# Altium project MB2032.PrjPCB
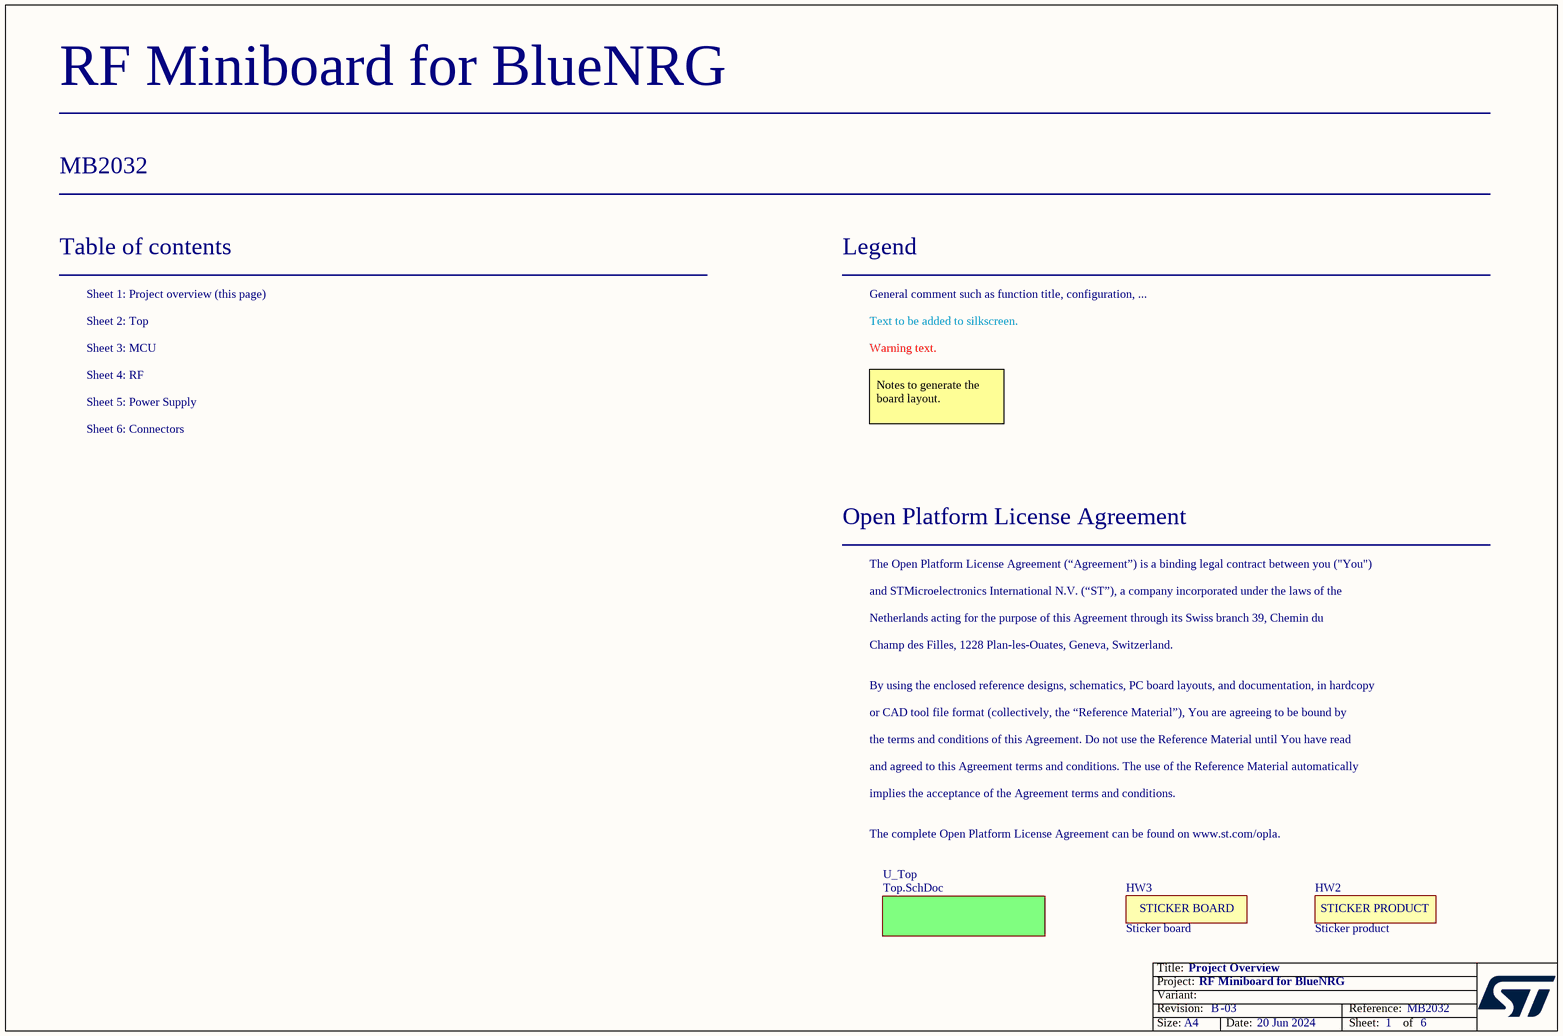
[diagram p0: Project_Overview.SchDoc]
Board_Reference: MB2032; Board_PCB_Revision: B; Board_Name: RF Miniboard for BlueNRG; Board_Document_Date: 20 Jun 2024; Board_Assembly_Revision: 03
6 sheets, 103 parts. Net scope: flat (ports and power ports of the same name join across sheets).
Board file: MB2032.PcbDoc
Sheets:
  Project_Overview.SchDoc
    U_Top = Top.SchDoc
      U_RF = RF.SchDoc
      U_Power_Supply = Power_Supply.SchDoc
      U_Connectors = Connectors.SchDoc
      U_MCU = MCU.SchDoc

## Sheet Project_Overview.SchDoc: Project Overview
size A4; Date: Not used; ApprovedBy: Not used; CheckedBy: Not used; Author: Not used; CompanyName: STMicroelectronics; DrawnBy: Not used; Engineer: Not used; Organization: Not used; Address1: Not used; Address2: Not used; Address3: Not used; Address4: Not used; DocumentNumber: Not used; Revision: Not used; SheetNumber: 1; SheetTotal: 6; CurrentTime: Not used; CurrentDate: Not used; Time: Not used; DocumentFullPathAndName: Not used; DocumentName: Not used; ModifiedDate: Not used; ImagePath: Not used; ProjectName: Not used; Application_BuildNumber: Not used

### Parts
HW2  value Sticker product  [STICKER_PRODUCT_25X5]  (hidden comment: STICKER_PRODUCT)  (no BOM)
HW3  value Sticker board  [STICKER_BOARD_25X5]  (hidden comment: STICKER_BOARD)  (no BOM)

### Sub-sheets
U_Top = Top.SchDoc: no entries

### Notes on the sheet
- Table of contents
- Sheet 1: Project overview (this page)
- Legend
- General comment such as function title, configuration, ...
- Sheet 2: Top
- Sheet 3: MCU
- Sheet 4: RF
- Text to be added to silkscreen.
- Warning text.
- Sheet 5: Power Supply
- Sheet 6: Connectors
- Notes to generate the board layout.
- Open Platform License Agreement
- The Open Platform License Agreement (“Agreement”) is a binding legal contract between you ("You")
- and STMicroelectronics International N.V. (“ST”), a company incorporated under the laws of the
- Netherlands acting for the purpose of this Agreement through its Swiss branch 39, Chemin du
- Champ des Filles, 1228 Plan-les-Ouates, Geneva, Switzerland.
- By using the enclosed reference designs, schematics, PC board layouts, and documentation, in hardcopy
- or CAD tool file format (collectively, the “Reference Material”), You are agreeing to be bound by
- the terms and conditions of this Agreement. Do not use the Reference Material until You have read
- and agreed to this Agreement terms and conditions. The use of the Reference Material automatically
- implies the acceptance of the Agreement terms and conditions.
- The complete Open Platform License Agreement can be found on www.st.com/opla.
- Title:
- Project:
- Size:
- Revision:
- Variant:
- A4
- -
- Date:
- Reference:
- Sheet:
- of
- (in symbol MCD-02189) STICKER PRODUCT
- (in symbol MCD-02190) STICKER BOARD

### Library data of the parts
HW2 = MCD-02189: Sticker product 25x5 mm; Part_Type: Misc; Part_Preference: Recommended; ID: 4289; ShowFields: YES; Internal_Part_Number: MCD-02189; Status: Released; Manufacturer: N/A; Manufacturer_Part_Number: N/A; Alternate_Manufacturer: N/A; Alternate_Manufacturer_Part_Number: N/A; ComponentLink1URL: N/A; Order_Code_Digikey: N/A; Order_Code_Farnell: N/A; Order_Code_RS: N/A
HW3 = MCD-02190: Sticker board 25x5 mm; Part_Type: Misc; Part_Preference: Recommended; ID: 4290; ShowFields: YES; Internal_Part_Number: MCD-02190; Status: Released; Manufacturer: N/A; Manufacturer_Part_Number: N/A; Alternate_Manufacturer: N/A; Alternate_Manufacturer_Part_Number: N/A; ComponentLink1URL: N/A; Order_Code_Digikey: N/A; Order_Code_Farnell: N/A; Order_Code_RS: N/A

## Sheet Top.SchDoc: Top Schematic
size A4; Date: Not used; ApprovedBy: Not used; CheckedBy: Not used; Author: Not used; CompanyName: STMicroelectronics; DrawnBy: Not used; Engineer: Not used; Organization: Not used; Address1: Not used; Address2: Not used; Address3: Not used; Address4: Not used; DocumentNumber: Not used; Revision: Not used; SheetNumber: 2; SheetTotal: 6; CurrentTime: Not used; CurrentDate: Not used; Time: Not used; DocumentFullPathAndName: Not used; DocumentName: Not used; ModifiedDate: Not used; ImagePath: Not used; ProjectName: Not used; Application_BuildNumber: Not used
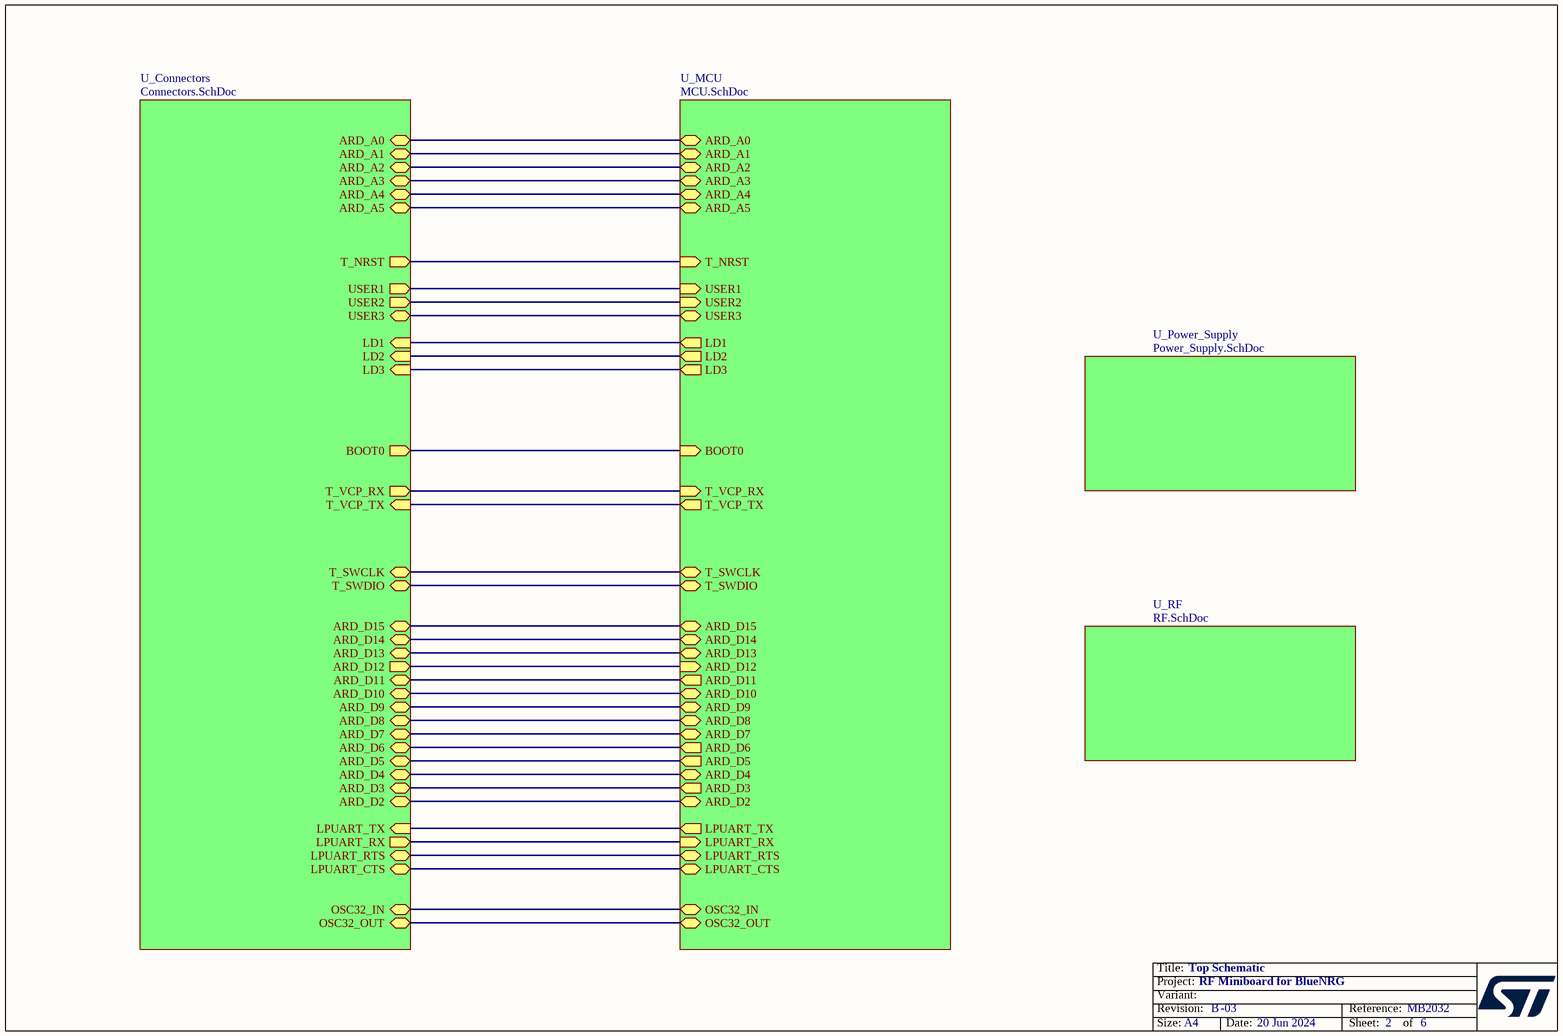
[diagram p1: Top.SchDoc]

### Sub-sheets
U_Connectors = Connectors.SchDoc: LD3 (in), LD1 (in), T_VCP_TX (in), T_SWCLK (bidir), T_SWDIO (bidir), T_VCP_RX (out), T_NRST (out), LD2 (in), OSC32_IN (bidir), OSC32_OUT (bidir), USER2 (out), USER1 (out), BOOT0 (out), ARD_D2 (bidir), USER3 (bidir), ARD_D9 (bidir), ARD_D13 (bidir), ARD_D10 (bidir), ARD_D12 (out), ARD_D14 (bidir), ARD_D15 (bidir), ARD_D11 (bidir), ARD_D8 (bidir), ARD_A1 (bidir), ARD_A0 (bidir), ARD_A2 (bidir), ARD_A3 (bidir), ARD_A4 (bidir), ARD_A5 (bidir), ARD_D7 (bidir), ARD_D6 (bidir), ARD_D3 (bidir), ARD_D4 (bidir), ARD_D5 (bidir), LPUART_TX (in), LPUART_RX (out), LPUART_RTS (bidir), LPUART_CTS (bidir)
U_MCU = MCU.SchDoc: T_NRST (in), LD2 (out), LD3 (out), LD1 (out), T_VCP_RX (in), T_SWCLK (bidir), T_SWDIO (bidir), T_VCP_TX (out), USER2 (in), USER1 (in), OSC32_OUT (bidir), OSC32_IN (bidir), BOOT0 (in), ARD_D2 (bidir), USER3 (bidir), ARD_D9 (bidir), ARD_D14 (bidir), ARD_D15 (bidir), ARD_D8 (bidir), ARD_D12 (in), ARD_D13 (bidir), ARD_A3 (bidir), ARD_A2 (bidir), ARD_A1 (bidir), ARD_A0 (bidir), ARD_A4 (bidir), ARD_A5 (bidir), ARD_D5 (out), ARD_D3 (out), ARD_D6 (out), ARD_D11 (out), ARD_D10 (bidir), ARD_D7 (bidir), ARD_D4 (bidir), LPUART_TX (out), LPUART_RX (in), LPUART_RTS (bidir), LPUART_CTS (bidir)
U_Power_Supply = Power_Supply.SchDoc: no entries
U_RF = RF.SchDoc: no entries

### Nets
(unnamed): sheet U_Connectors/LD3, sheet U_MCU/LD3
(unnamed): sheet U_Connectors/LD1, sheet U_MCU/LD1
(unnamed): sheet U_Connectors/T_VCP_TX, sheet U_MCU/T_VCP_TX
(unnamed): sheet U_Connectors/T_SWCLK, sheet U_MCU/T_SWCLK
(unnamed): sheet U_Connectors/T_SWDIO, sheet U_MCU/T_SWDIO
(unnamed): sheet U_Connectors/T_VCP_RX, sheet U_MCU/T_VCP_RX
(unnamed): sheet U_Connectors/T_NRST, sheet U_MCU/T_NRST
(unnamed): sheet U_Connectors/LD2, sheet U_MCU/LD2
(unnamed): sheet U_Connectors/OSC32_IN, sheet U_MCU/OSC32_IN
(unnamed): sheet U_Connectors/OSC32_OUT, sheet U_MCU/OSC32_OUT
(unnamed): sheet U_Connectors/USER2, sheet U_MCU/USER2
(unnamed): sheet U_Connectors/USER1, sheet U_MCU/USER1
(unnamed): sheet U_Connectors/BOOT0, sheet U_MCU/BOOT0
(unnamed): sheet U_Connectors/ARD_D2, sheet U_MCU/ARD_D2
(unnamed): sheet U_Connectors/USER3, sheet U_MCU/USER3
(unnamed): sheet U_Connectors/ARD_D9, sheet U_MCU/ARD_D9
(unnamed): sheet U_Connectors/ARD_D13, sheet U_MCU/ARD_D13
(unnamed): sheet U_Connectors/ARD_D10, sheet U_MCU/ARD_D10
(unnamed): sheet U_Connectors/ARD_D12, sheet U_MCU/ARD_D12
(unnamed): sheet U_Connectors/ARD_D14, sheet U_MCU/ARD_D14
(unnamed): sheet U_Connectors/ARD_D15, sheet U_MCU/ARD_D15
(unnamed): sheet U_Connectors/ARD_D11, sheet U_MCU/ARD_D11
(unnamed): sheet U_Connectors/ARD_D8, sheet U_MCU/ARD_D8
(unnamed): sheet U_Connectors/ARD_A1, sheet U_MCU/ARD_A1
(unnamed): sheet U_Connectors/ARD_A0, sheet U_MCU/ARD_A0
(unnamed): sheet U_Connectors/ARD_A2, sheet U_MCU/ARD_A2
(unnamed): sheet U_Connectors/ARD_A3, sheet U_MCU/ARD_A3
(unnamed): sheet U_Connectors/ARD_A4, sheet U_MCU/ARD_A4
(unnamed): sheet U_Connectors/ARD_A5, sheet U_MCU/ARD_A5
(unnamed): sheet U_Connectors/ARD_D7, sheet U_MCU/ARD_D7
(unnamed): sheet U_Connectors/ARD_D6, sheet U_MCU/ARD_D6
(unnamed): sheet U_Connectors/ARD_D3, sheet U_MCU/ARD_D3
(unnamed): sheet U_Connectors/ARD_D4, sheet U_MCU/ARD_D4
(unnamed): sheet U_Connectors/ARD_D5, sheet U_MCU/ARD_D5
(unnamed): sheet U_Connectors/LPUART_TX, sheet U_MCU/LPUART_TX
(unnamed): sheet U_Connectors/LPUART_RX, sheet U_MCU/LPUART_RX
(unnamed): sheet U_Connectors/LPUART_RTS, sheet U_MCU/LPUART_RTS
(unnamed): sheet U_Connectors/LPUART_CTS, sheet U_MCU/LPUART_CTS

### Notes on the sheet
- Title:
- Project:
- Size:
- Revision:
- Variant:
- A4
- -
- Date:
- Reference:
- Sheet:
- of

## Sheet RF.SchDoc: RF
size A4; Date: Not used; ApprovedBy: Not used; CheckedBy: Not used; Author: Not used; CompanyName: STMicroelectronics; DrawnBy: Not used; Engineer: Not used; Organization: Not used; Address1: Not used; Address2: Not used; Address3: Not used; Address4: Not used; DocumentNumber: Not used; Revision: Not used; SheetNumber: 4; SheetTotal: 6; CurrentTime: Not used; CurrentDate: Not used; Time: Not used; DocumentFullPathAndName: Not used; DocumentName: Not used; ModifiedDate: Not used; ImagePath: Not used; ProjectName: Not used; Application_BuildNumber: Not used
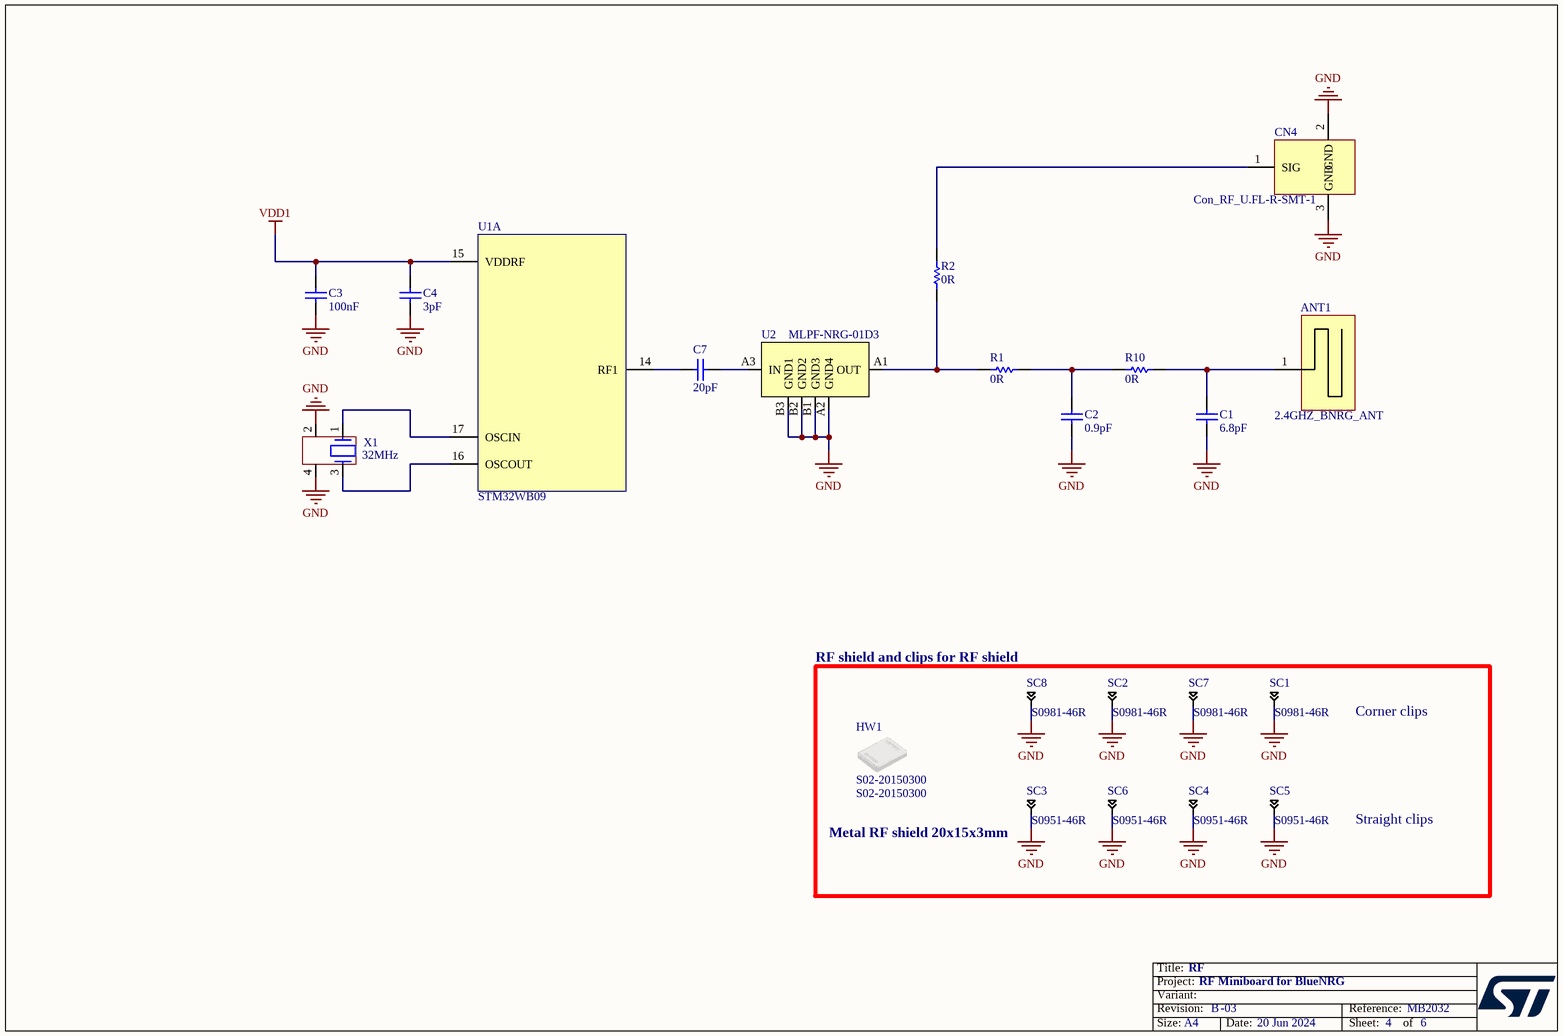
[diagram p2: RF.SchDoc]

### Parts
ANT1  value 2.4GHZ_BNRG_ANT  [ANT_BT_BNRG_2P4GHZ_MB2032]  (hidden comment: 2.4GHz_BT_ANT)  (no BOM)
C1  value 6.8pF  [C0402]  (hidden comment: Capacitor)
C2  value 0.9pF  [C0402_MURATA_GJM155_H0P5]  (hidden comment: Capacitor)
C3  value 100nF  [C0402]  (hidden comment: Capacitor)
C4  value 3pF  [C0402]  (hidden comment: Capacitor)
C7  value 20pF  [C0201_H0P3]  (hidden comment: Capacitor)
CN4  value Con_RF_U.FL-R-SMT-1  [CON_HRS_U.FL-R-SMT-1]  (hidden comment: U.FL-R-SMT-1)
HW1  S02-20150300  [SHIELD_HARWIN_S02-20150300_15X20_H3]
R1  value 0R  [R0402]  (hidden comment: Resistor)
R2  value 0R  [r0402]  (hidden comment: Resistor)
R10  value 0R  [R0402]  (hidden comment: Resistor)
SC1  value S0981-46R  [CLIP_HARWIN_S0981-46R]  (hidden comment: Shield-clip_S0951-46R)
SC2  value S0981-46R  [CLIP_HARWIN_S0981-46R]  (hidden comment: Shield-clip_S0951-46R)
SC3  value S0951-46R  [CLIP_HARWIN_S0951-46R]  (hidden comment: Shield-clip_S0951-46R)
SC4  value S0951-46R  [CLIP_HARWIN_S0951-46R]  (hidden comment: Shield-clip_S0951-46R)
SC5  value S0951-46R  [CLIP_HARWIN_S0951-46R]  (hidden comment: Shield-clip_S0951-46R)
SC6  value S0951-46R  [CLIP_HARWIN_S0951-46R]  (hidden comment: Shield-clip_S0951-46R)
SC7  value S0981-46R  [CLIP_HARWIN_S0981-46R]  (hidden comment: Shield-clip_S0951-46R)
SC8  value S0981-46R  [CLIP_HARWIN_S0981-46R]  (hidden comment: Shield-clip_S0951-46R)
U1  STM32WB09  [ICC_QFN32-EPAD_5X5_P050]  (part A of 5)
U2  value MLPF-NRG-01D3  [ICC_CSPG_6BUMPS_1X1P60_P050-P0577]  (hidden comment: MLPF-WB55-01E3)
X1  value 32MHz  [CRY_NX2016SA_4P]  (hidden comment: XTAL_4_PINS)

### Nets
GND: C1.1 C2.1 C3.1 C4.1 CN4.2(GND) CN4.3(GND) SC1.1 SC2.1 SC3.1 SC4.1 SC5.1 SC6.1 SC7.1 SC8.1 U2.A2(GND4) U2.B1(GND3) U2.B2(GND2) U2.B3(GND1) X1.2 X1.4
VDD1: C3.2 C4.2 U1.15(VDDRF)
NetANT1_1: ANT1.1 C1.2 R10.2
NetC2_2: C2.2 R1.2 R10.1
NetC7_1: C7.1 U1.14(RF1)
NetC7_2: C7.2 U2.A3(IN)
NetCN4_1: CN4.1(SIG) R2.2
NetR1_1: R1.1 R2.1 U2.A1(OUT)
NetU1_16: U1.16(OSCOUT) X1.3
NetU1_17: U1.17(OSCIN) X1.1

### Notes on the sheet
- (near SC8) RF shield and clips for RF shield
- Corner clips
- (near SC3) Metal RF shield 20x15x3mm
- Straight clips
- Title:
- Project:
- Size:
- Revision:
- Variant:
- A4
- -
- Date:
- Reference:
- Sheet:
- of

### Library data of the parts
ANT1 = MCD-03495: 2.4 GHZ Bluetooth BNRG PCB antenna; Part_Type: Misc; Part_Preference: Recommended; ShowFields: YES; ID: 5611; Component_Country_Of_Origin: Unknown; Internal_Part_Number: MCD-03495; Status: Checked; Manufacturer: N/A; Manufacturer_Part_Number: N/A; ComponentLink1URL: http://tunmcdsvn.tun.st.com/Component_Documentation_Library/Trunk; Order_Code_Digikey: N/A; Order_Code_Farnell: N/A; Order_Code_RS: N/A
C1 = MCD-03452: Capacitor, MLCC, 6.8pF, 50V, C0G, +/-0.05pF, 0402, T=0.5mm; Part_Preference: Recommended; Manufacturer: MURATA; Manufacturer_Part_Number: GJM1555C1H6R8WB01; Order_Code_RS: 3243259RL; ShowFields: YES; ID: 5568; Component_Country_Of_Origin: Japan, Singapore; Internal_Part_Number: MCD-03452; Status: Checked; Part_Type: Capacitor; Package: 0402; ComponentLink1URL: http://tunmcdsvn.tun.st.com/Component_Documentation_Library/Trunk/Capacitor/MURATA_GJM_Series/GJM1555C1H6R8WB01; Order_Code_Digikey: 490-14447-2-ND; Order_Code_Farnell: 3243259RL
C2 = MCD-04106: Capacitor, MLCC, 0.9pF, 50V, COG, +/-0.05pF, 0402, T=0.5mm; Part_Preference: Recommended; Manufacturer: MURATA; Manufacturer_Part_Number: GJM1555C1HR90WB01; Order_Code_RS: 185-3185; ShowFields: YES; ID: 6222; Internal_Part_Number: MCD-04106; Status: Checked; Part_Type: Capacitor; Package: 0402; ComponentLink1URL: http://tunmcdsvn.tun.st.com/Component_Documentation_Library/Trunk/Capacitor/MURATA_GJM_Series/GJM1555C1HR90WB01D; Order_Code_Digikey: 490-11254-2-ND; Order_Code_Farnell: 3243276
C3 = MCD-03442: Capacitor, MLCC, 100nF, ±10%, X7R, 25V, 0402, T=0.5mm; Part_Preference: Recommended; Manufacturer: MURATA; Manufacturer_Part_Number: GRM155R71E104KE14D; Order_Code_RS: NA; ShowFields: YES; ID: 5558; Component_Country_Of_Origin: China, Japan, Philippines, Singapore; Internal_Part_Number: MCD-03442; Status: Checked; Part_Type: Capacitor; Package: 0402; ComponentLink1URL: http://tunmcdsvn.tun.st.com/Component_Documentation_Library/Trunk/Capacitor/MURATA_GRM_Series/GRM155R71E104KE14; Order_Code_Digikey: 490-10698-2-ND; Order_Code_Farnell: NA
C4 = MCD-03898: Capacitor, C0G, 3 pF, 50V, NPO, ±0.1pF, 0402, T=0.5mm; Part_Preference: Recommended; Manufacturer: WALSIN TECHNOLOGY CORPORATION; Manufacturer_Part_Number: 0402N3R0B500CT; Order_Code_RS: NA; ShowFields: YES; ID: 6014; Internal_Part_Number: MCD-03898; Status: New; Part_Type: Capacitor; Package: 0402; ComponentLink1URL: http://tunmcdsvn.tun.st.com/Component_Documentation_Library/Trunk/Capacitor/WALSIN_Monolithic_Series/0402N3R0B500CT; Order_Code_Digikey: 1292-1315-2-ND; Order_Code_Farnell: NA
C7 = MCD-03543: Capacitor, MLCC, 20pF, 25V, COG, +/-2%, 0201, T=0.33mm; Part_Preference: Recommended; Manufacturer: MURATA; Manufacturer_Part_Number: GJM0335C1E200GB01; ShowFields: YES; ID: 5659; Component_Country_Of_Origin: Japan, Singapore; Internal_Part_Number: MCD-03543; Status: Checked; Part_Type: Capacitor; ComponentLink1URL: http://tunmcdsvn.tun.st.com/Component_Documentation_Library/Trunk/Capacitor/MURATA_GJM_Series; Order_Code_Digikey: 490-GJM0335C1E200GB01DTR-ND; Order_Code_Farnell: 2994012; Order_Code_RS: N/A; Package: 0201
CN4 = MCD-01583: Connector_RF, 0Hz to 6GHz, 50R, VR, SMD, T= 1.25mm; BMS_Part_Number: 9187005; Part_Preference: Recommended; Manufacturer: HIROSE; Order_Code_RS: 557-981; Component_Country_Of_Origin: Japan, Malaysia; ShowFields: YES; ID: 3683; Internal_Part_Number: MCD-01583; Status: Released; Part_Type: Connector; Manufacturer_Part_Number: U.FL-R-SMT-1; ComponentLink1URL: http://tunmcdsvn.tun.st.com/Component_Documentation_Library/Trunk/Connector/HIROSE_U.FL_Series/; Order_Code_Digikey: N/A; Order_Code_Farnell: 1688077
HW1 = MCD-03126: RFI shield can, 20x15x3mm; Part_Type: Misc; Part_Preference: Recommended; Manufacturer: HARWIN; Order_Code_RS: 161-3687; Component_Country_Of_Origin: UK°; ShowFields: YES; ID: 5242; ComponentLink1URL: http://tunmcdsvn.tun.st.com/Component_Documentation_Library/Trunk/Misc/HARWIN_S02-20150300; Internal_Part_Number: MCD-03126; Value: S02-20150300; Status: Checked; Manufacturer_Part_Number: S02-20150300; Package: 20x15x3mm; Order_Code_Digikey: 952-2632-ND; Order_Code_Farnell: 3755471
R1 R2 R10 = MCD-00052: Resistor, 0R, 0402, +/-5%, 1/16W; Part_Preference: Recommended; Manufacturer: YAGEO; Manufacturer_Part_Number: RC0402JR-070RL; Order_Code_RS: 9232516RL; Component_Country_Of_Origin: China; ShowFields: YES; ID: 2540; Internal_Part_Number: MCD-00052; Status: Released; Part_Type: Resistor; Package: 0402; ComponentLink1URL: http://tunmcdsvn.tun.st.com/Component_Documentation_Library/Trunk/Resistor/YAGEO_RC_L_Series; Order_Code_Digikey: 311-0.0JRCT-ND; Order_Code_Farnell: 9232516RL
SC1 SC2 SC7 SC8 = MCD-02164: shield clip Harwin S0981-46R to fix RF shielded cavity - SMT RFI Shield Clip, Corner (T+R); Part_Type: Mechanical; Part_Preference: Recommended; Order_Code_RS: 161-3702; Component_Country_Of_Origin: South Korea; ShowFields: YES; ID: 4264; Internal_Part_Number: MCD-02164; Status: Released; Manufacturer: HARWIN; Manufacturer_Part_Number: S0981-46R; ComponentLink1URL: http://tunmcdsvn.tun.st.com/Component_Documentation_Library/Trunk/Misc/HARWIN_S0981-46R; Order_Code_Digikey: 952-2518-1-ND; Order_Code_Farnell: 2361678; Package: 0.8x4.7x1.4mm
SC3-SC6 = MCD-01587: shield clip Harwin S0951-46R to fix RF shielded cavity; Part_Type: Mechanical; Part_Preference: Recommended; Component_Country_Of_Origin: South Korea; ShowFields: YES; ID: 3687; Internal_Part_Number: MCD-01587; Status: Released; Manufacturer: HARWIN; Manufacturer_Part_Number: S0951-46R; ComponentLink1URL: http://tunmcdsvn.tun.st.com/Component_Documentation_Library/Trunk/Misc/HARWIN_S0951-46R; Order_Code_Digikey: 952-2669-1-ND; Order_Code_Farnell: 2490970; Order_Code_RS: N/A; Package: 1.1x3.9mm
U1 = MCD-03444: Bluetooth® Low Energy wireless SoC; Part_Type: IC; Part_Preference: Recommended; Manufacturer: STMICROELECTRONICS; Component_Country_Of_Origin: Unknown; ShowFields: YES; ID: 5560; Internal_Part_Number: MCD-03444; Value: STM32WB09; Status: Checked; Manufacturer_Part_Number: STM32WB09; Package: QFN32; ComponentLink1URL: http://tunmcdsvn.tun.st.com/Component_Documentation_Library/Trunk/IC/STMICROELECTRONICS_BLUENRG-372AC; Order_Code_Digikey: N/A; Order_Code_Farnell: N/A; Order_Code_RS: N/A
U2 = MCD-03490: 2.4 GHz low pass filter matched to BLUENRG-LP-LPS; Part_Type: IC; Part_Preference: Recommended; Manufacturer: STMICROELECTRONICS; ShowFields: YES; ID: 5606; Component_Country_Of_Origin: China; Internal_Part_Number: MCD-03490; Status: Checked; Manufacturer_Part_Number: MLPF-NRG-01D3; Package: CSP; ComponentLink1URL: http://tunmcdsvn.tun.st.com/Component_Documentation_Library/Trunk/IC/STMICROELECTRONICS_MLPF-NRG-01D3; Order_Code_Digikey: 497-MLPF-NRG-01D3TR-ND; Order_Code_Farnell: N/A; Order_Code_RS: N/A
X1 = MCD-01446: Crystal, 32MHz, 8pF, +/-10ppm, 60R, 2x1.6mm; BMS_Part_Number: 9157042; Part_Type: Crystal_Osc; Part_Preference: Recommended; Manufacturer: NDK; Manufacturer_Part_Number: NX2016SA-32MHZ-EXS00A-CS06654; Component_Country_Of_Origin: Unknown; ShowFields: YES; ID: 3546; Internal_Part_Number: MCD-01446; Status: Checked; Package: 2x1.6mm; ComponentLink1URL: http://tunmcdsvn.tun.st.com/Component_Documentation_Library/Trunk/Crytal_Oscillator/NDK_NX2016SA_Series; Order_Code_Digikey: 644-1373; Order_Code_Farnell: N/A; Order_Code_RS: N/A

## Sheet Power_Supply.SchDoc: Power Supply
size A4; Date: Not used; ApprovedBy: Not used; CheckedBy: Not used; Author: Not used; CompanyName: STMicroelectronics; DrawnBy: Not used; Engineer: Not used; Organization: Not used; Address1: Not used; Address2: Not used; Address3: Not used; Address4: Not used; DocumentNumber: Not used; Revision: Not used; SheetNumber: 5; SheetTotal: 6; CurrentTime: Not used; CurrentDate: Not used; Time: Not used; DocumentFullPathAndName: Not used; DocumentName: Not used; ModifiedDate: Not used; ImagePath: Not used; ProjectName: Not used; Application_BuildNumber: Not used
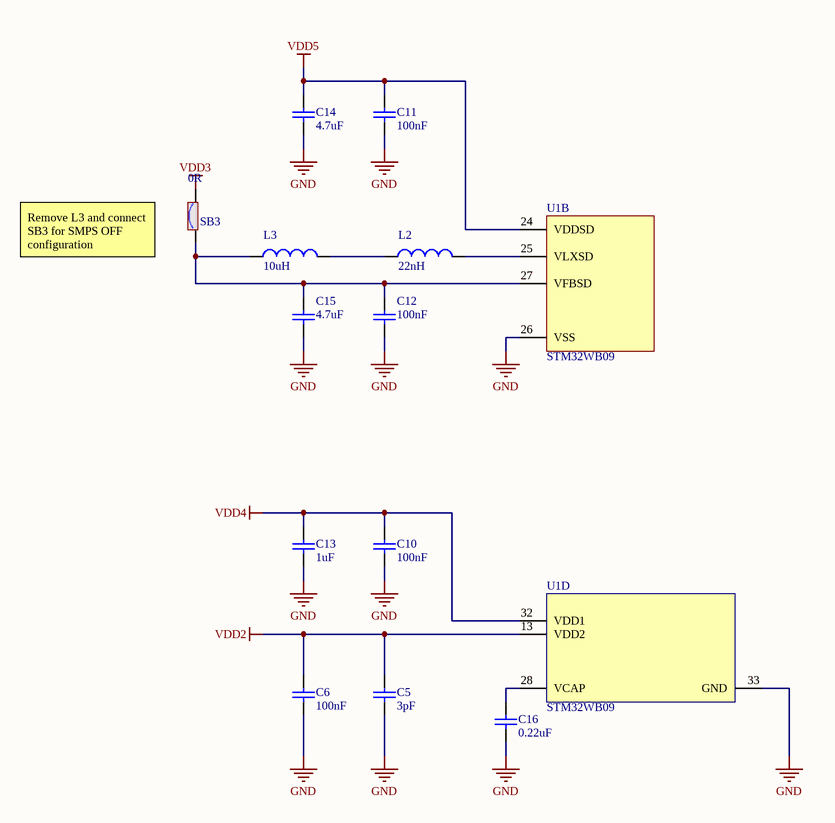
[diagram p3: Power_Supply.SchDoc]

### Parts
C5  value 3pF  [C0402]  (hidden comment: Capacitor)
C6  value 100nF  [C0402]  (hidden comment: Capacitor)
C10  value 100nF  [C0402]  (hidden comment: Capacitor)
C11  value 100nF  [C0402]  (hidden comment: Capacitor)
C12  value 100nF  [C0402]  (hidden comment: Capacitor)
C13  value 1uF  [C0402]  (hidden comment: Capacitor)
C14  value 4.7uF  [C0402]  (hidden comment: Capacitor)
C15  value 4.7uF  [C0402]  (hidden comment: Capacitor)
C16  value 0.22uF  [C0402]  (hidden comment: Capacitor)
L2  value 22nH  [C0402]  (hidden comment: Inductor)
L3  value 10uH  [IND_0805_MURATA_LQM21]  (hidden comment: Inductor)
SB3  value 0R  [SOLDER-BRIDGE_R0402-0R]  (hidden comment: SB_ON)
U1  STM32WB09  [ICC_QFN32-EPAD_5X5_P050]  (parts B,D of 5)

### Nets
GND: C5.1 C6.1 C10.1 C11.1 C12.1 C13.1 C14.1 C15.1 C16.1 U1.26(VSS) U1.33(GND)
VDD2: C5.2 C6.2 U1.13(VDD2)
VDD3: SB3.2
VDD4: C10.2 C13.2 U1.32(VDD1)
VDD5: C11.2 C14.2 U1.24(VDDSD)
NetC12_2: C12.2 C15.2 L3.1 SB3.1 U1.27(VFBSD)
NetC16_2: C16.2 U1.28(VCAP)
NetL2_1: L2.1 L3.2
NetL2_2: L2.2 U1.25(VLXSD)

### Notes on the sheet
- (near SB3) Remove L3 and connect SB3 for SMPS OFF configuration
- Title:
- Project:
- Size:
- Revision:
- Variant:
- A4
- -
- Date:
- Reference:
- Sheet:
- of

### Library data of the parts
C5 = MCD-03898: as C4 on sheet RF; Internal_Part_Number: MCD-03898; Status: New; Part_Type: Capacitor; Package: 0402; ComponentLink1URL: http://tunmcdsvn.tun.st.com/Component_Documentation_Library/Trunk/Capacitor/WALSIN_Monolithic_Series/0402N3R0B500CT; Order_Code_Digikey: 1292-1315-2-ND; Order_Code_Farnell: NA
C6 C10-C12 = MCD-03442: as C3 on sheet RF; Internal_Part_Number: MCD-03442; Status: Checked; Part_Type: Capacitor; Package: 0402; ComponentLink1URL: http://tunmcdsvn.tun.st.com/Component_Documentation_Library/Trunk/Capacitor/MURATA_GRM_Series/GRM155R71E104KE14; Order_Code_Digikey: 490-10698-2-ND; Order_Code_Farnell: NA
C13 = MCD-03432: Capacitor, MLCC, 1uF, X7R, 6.3V, 0402, ± 10%, T=0.5mm; Part_Preference: Recommended; Manufacturer: MURATA; Manufacturer_Part_Number: GRM155R70J105KA12; Order_Code_RS: 113-8711; ShowFields: YES; ID: 5548; Component_Country_Of_Origin: China, Japan, Philippines, Singapore; Internal_Part_Number: MCD-03432; Status: Checked; Part_Type: Capacitor; Package: 0402; ComponentLink1URL: http://tunmcdsvn.tun.st.com/Component_Documentation_Library/Trunk/Capacitor/MURATA_GRM_Series/GRM155R70J105KA12; Order_Code_Digikey: NA; Order_Code_Farnell: NA
C14 C15 = MCD-03431: Capacitor, MLCC, 4.7uF, X5R, 10 V, 0402, ± 20%, T=0.5mm; Part_Preference: Recommended; Manufacturer: MURATA; Manufacturer_Part_Number: GRM155R61A475MEAAD; Order_Code_RS: 172-6870; ShowFields: YES; ID: 5547; Component_Country_Of_Origin: China, Japan, Philippines, Singapore; Internal_Part_Number: MCD-03431; Status: Checked; Part_Type: Capacitor; Package: 0402; ComponentLink1URL: http://tunmcdsvn.tun.st.com/Component_Documentation_Library/Trunk/Capacitor/MURATA_GRM_Series/GRM155R61A475MEAAD; Order_Code_Digikey: 90-14306-2-ND; Order_Code_Farnell: 2688503RL
C16 = MCD-03483: Capacitor, MLCC, 0.22uF, X5R, 6.3V, +/-10%, 0402, T=0.5mm; Part_Preference: Recommended; Manufacturer: YAGEO; Manufacturer_Part_Number: CC0402KRX5R5BB224; Order_Code_RS: 3369131; ShowFields: YES; ID: 5599; Component_Country_Of_Origin: China; Internal_Part_Number: MCD-03483; Status: Checked; Part_Type: Capacitor; Package: 0402; ComponentLink1URL: http://tunmcdsvn.tun.st.com/Component_Documentation_Library/Trunk/Capacitor/YAGEO_X5R_Series; Order_Code_Digikey: 311-1681-2-ND; Order_Code_Farnell: 3369131
L2 = MCD-03439: Inductor, MLCC, 22nH, ±2%, 350mA, 0.58R, 0402, T=1.45mm; Part_Preference: Recommended; Manufacturer: MURATA; Manufacturer_Part_Number: LQG15HN22NG02D; Order_Code_RS: 3354168; ShowFields: YES; ID: 5555; Component_Country_Of_Origin: Japan; Internal_Part_Number: MCD-03439; Status: Checked; Part_Type: Inductor; Package: 0402; ComponentLink1URL: http://tunmcdsvn.tun.st.com/Component_Documentation_Library/Trunk/Inductor/MURATA_LQG15HN22NG02D; Order_Code_Digikey: 490-LQG15HN22NG02DTR-ND; Order_Code_Farnell: 3354168
L3 = MCD-03438: Inductor, MLCC, 10uH, ±20%, 300mA, 845mR, 0805, T=1.45mm; Part_Preference: Recommended; Manufacturer: MURATA; Manufacturer_Part_Number: LQM21DN100M70L; Order_Code_RS: NA; ShowFields: YES; ID: 5554; Component_Country_Of_Origin: Japan; Internal_Part_Number: MCD-03438; Status: Checked; Part_Type: Inductor; Package: 0805; ComponentLink1URL: http://tunmcdsvn.tun.st.com/Component_Documentation_Library/Trunk/Inductor/MURATA_LQM21DN100M70L; Order_Code_Digikey: 490-LQM21DN100M70LTR-ND; Order_Code_Farnell: NA
SB3 = MCD-01618: Solder Bridge 0402 ON; Part_Type: Resistor; Part_Preference: Recommended; Manufacturer: YAGEO; Manufacturer_Part_Number: RC0402JR-070RL; Order_Code_RS: 618-5804; Component_Country_Of_Origin: China; ShowFields: YES; ID: 3718; Internal_Part_Number: MCD-01618; Status: Released; Package: 0402; ComponentLink1URL: http://tunmcdsvn.tun.st.com/Component_Documentation_Library/Trunk/Resistor/YAGEO_RC0402_Series; Order_Code_Digikey: 311-0.0JRTR-ND; Order_Code_Farnell: 2363467
U1 = MCD-03444: as U1 on sheet RF; Internal_Part_Number: MCD-03444; Value: STM32WB09; Status: Checked; Manufacturer_Part_Number: STM32WB09; Package: QFN32; ComponentLink1URL: http://tunmcdsvn.tun.st.com/Component_Documentation_Library/Trunk/IC/STMICROELECTRONICS_BLUENRG-372AC; Order_Code_Digikey: N/A; Order_Code_Farnell: N/A; Order_Code_RS: N/A

## Sheet Connectors.SchDoc: Connectors
size A4; Date: Not used; ApprovedBy: Not used; CheckedBy: Not used; Author: Not used; CompanyName: STMicroelectronics; DrawnBy: Not used; Engineer: Not used; Organization: Not used; Address1: Not used; Address2: Not used; Address3: Not used; Address4: Not used; DocumentNumber: Not used; Revision: Not used; SheetNumber: 6; SheetTotal: 6; CurrentTime: Not used; CurrentDate: Not used; Time: Not used; DocumentFullPathAndName: Not used; DocumentName: Not used; ModifiedDate: Not used; ImagePath: Not used; ProjectName: Not used; Application_BuildNumber: Not used
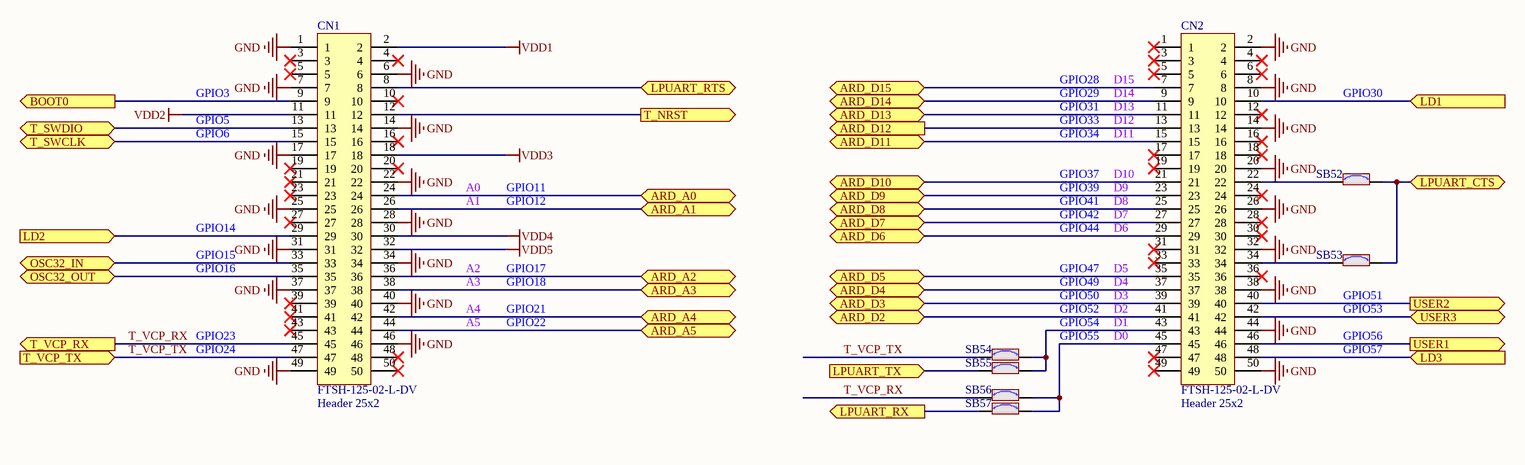
[diagram p4: Connectors.SchDoc]

### Parts
CN1  FTSH-125-02-L-DV  value Header 25x2  [CON_SAMTEC_FTSH-125-02-L-DV]
CN2  FTSH-125-02-L-DV  value Header 25x2  [CON_SAMTEC_FTSH-125-02-L-DV]
SB52  SB_ON  [SOLDER-BRIDGE_R0402-0R]  (value not drawn)
SB53  SB_ON  [SOLDER-BRIDGE_R0402-0R]  (value not drawn)
SB54  SB_ON  [SOLDER-BRIDGE_R0402-0R]  (value not drawn)
SB55  SB_ON  [SOLDER-BRIDGE_R0402-0R]  (value not drawn)
SB56  SB_ON  [SOLDER-BRIDGE_R0402-0R]  (value not drawn)
SB57  SB_ON  [SOLDER-BRIDGE_R0402-0R]  (value not drawn)

### Ports
ARD_A0 (bidir), ARD_A1 (bidir), ARD_A2 (bidir), ARD_A3 (bidir), ARD_A4 (bidir), ARD_A5 (bidir), ARD_D2 (bidir), ARD_D3 (bidir), ARD_D4 (bidir), ARD_D5 (bidir), ARD_D6 (bidir), ARD_D7 (bidir), ARD_D8 (bidir), ARD_D9 (bidir), ARD_D10 (bidir), ARD_D11 (bidir), ARD_D12 (out), ARD_D13 (bidir), ARD_D14 (bidir), ARD_D15 (bidir), BOOT0 (out), LD1 (in), LD2 (in), LD3 (in), LPUART_CTS (bidir), LPUART_RTS (bidir), LPUART_RX (out), LPUART_TX (in), OSC32_IN (bidir), OSC32_OUT (bidir), T_NRST (out), T_SWCLK (bidir), T_SWDIO (bidir), T_VCP_RX (out), T_VCP_TX (in), USER1 (out), USER2 (out), USER3 (bidir)

### Nets
GND: CN1.1 CN1.6 CN1.7 CN1.14 CN1.17 CN1.22 CN1.25 CN1.28 CN1.31 CN1.34 CN1.37 CN1.40 CN1.46 CN1.49 CN2.2 CN2.8 CN2.14 CN2.20 CN2.26 CN2.32 CN2.38 CN2.44 CN2.50
VDD1: CN1.2
VDD2: CN1.11
VDD3: CN1.18
VDD4: CN1.30
VDD5: CN1.32
ARD_A0: CN1.24 ; port ARD_A0
ARD_A1: CN1.26 ; port ARD_A1
ARD_A2: CN1.36 ; port ARD_A2
ARD_A3: CN1.38 ; port ARD_A3
ARD_A4: CN1.42 ; port ARD_A4
ARD_A5: CN1.44 ; port ARD_A5
ARD_D2: CN2.41 ; port ARD_D2
ARD_D3: CN2.39 ; port ARD_D3
ARD_D4: CN2.37 ; port ARD_D4
ARD_D5: CN2.35 ; port ARD_D5
ARD_D6: CN2.29 ; port ARD_D6
ARD_D7: CN2.27 ; port ARD_D7
ARD_D8: CN2.25 ; port ARD_D8
ARD_D9: CN2.23 ; port ARD_D9
ARD_D10: CN2.21 ; port ARD_D10
ARD_D11: CN2.15 ; port ARD_D11
ARD_D12: CN2.13 ; port ARD_D12
ARD_D13: CN2.11 ; port ARD_D13
ARD_D14: CN2.9 ; port ARD_D14
ARD_D15: CN2.7 ; port ARD_D15
BOOT0: CN1.9 ; port BOOT0
LD1: CN2.10 ; port LD1
LD2: CN1.29 ; port LD2
LD3: CN2.48 ; port LD3
LPUART_CTS: SB52.2 SB53.2 ; port LPUART_CTS
LPUART_RTS: CN1.8 ; port LPUART_RTS
LPUART_RX: SB57.1 ; port LPUART_RX
LPUART_TX: SB55.1 ; port LPUART_TX
OSC32_IN: CN1.33 ; port OSC32_IN
OSC32_OUT: CN1.35 ; port OSC32_OUT
T_NRST: CN1.12 ; port T_NRST
T_SWCLK: CN1.15 ; port T_SWCLK
T_SWDIO: CN1.13 ; port T_SWDIO
T_VCP_RX: CN1.45 SB56.1 ; port T_VCP_RX
T_VCP_TX: CN1.47 SB54.1 ; port T_VCP_TX
USER1: CN2.46 ; port USER1
USER2: CN2.40 ; port USER2
USER3: CN2.42 ; port USER3
NetCN2_22: CN2.22 SB52.1
NetCN2_34: CN2.34 SB53.1
NetCN2_43: CN2.43 SB54.2 SB55.2
NetCN2_45: CN2.45 SB56.2 SB57.2

Not connected (* = marked no-connect by the designer): CN1 3* 4* 5* 10* 16* 19* 20* 21* 23* 27* 39* 41* 43* 48* 50*; CN2 1* 3* 4* 5* 6* 12* 16* 17* 18* 19* 24* 28* 30* 31* 33* 36* 47* 49*

### Notes on the sheet
- GPIO3
- GPIO5
- GPIO28
- GPIO29
- GPIO31
- GPIO33
- (near CN2) D12
- (near CN2) D13
- (near CN2) D14
- (near CN2) D15
- GPIO30
- GPIO6
- A0
- GPIO11
- GPIO34
- GPIO37
- GPIO39
- D9
- (near CN2) D10
- (near CN2) D11
- GPIO14
- GPIO15
- A1
- GPIO12
- GPIO41
- GPIO42
- GPIO44
- D8
- D7
- D6
- GPIO16
- A2
- A3
- A4
- A5
- GPIO17
- GPIO18
- GPIO21
- GPIO22
- GPIO54
- GPIO52
- GPIO47
- GPIO49
- GPIO50
- D1
- D2
- D5
- D4
- D3
- (near SB53) GPIO51
- (near SB53) GPIO53
- GPIO23
- GPIO24
- GPIO55
- D0
- GPIO56
- GPIO57
- Title:
- Project:
- Size:
- Revision:
- Variant:
- -
- Date:
- Reference:
- Sheet:
- of

### Library data of the parts
CN1 CN2 = MCD-02746: Header, 25x2, 12.7mm, VR, SMD, T=4.83mm; Part_Type: Connector; Part_Preference: Recommended; Manufacturer: SAMTEC; Component_Country_Of_Origin: China, Costa Rica, Malaysia, USA, Vietnam; ShowFields: YES; ID: 4858; ComponentLink1URL: http://tunmcdsvn.tun.st.com/Component_Documentation_Library/Trunk/Connector/SAMTEC_FTSH_Series; Internal_Part_Number: MCD-02746; Status: Checked; Manufacturer_Part_Number: FTSH-125-02-L-DV; Order_Code_Digikey: FTSH-125-02-L-DV-ND; Order_Code_Farnell: 3751075; Order_Code_RS: N/A
SB52-SB57 = MCD-01618: Solder Bridge 0402 ON; Part_Type: Resistor; Part_Preference: Recommended; Manufacturer: YAGEO; Manufacturer_Part_Number: RC0402JR-070RL; Value: 0R; Order_Code_RS: 618-5804; Component_Country_Of_Origin: China; ShowFields: YES; ID: 3718; Internal_Part_Number: MCD-01618; Status: Released; Package: 0402; ComponentLink1URL: http://tunmcdsvn.tun.st.com/Component_Documentation_Library/Trunk/Resistor/YAGEO_RC0402_Series; Order_Code_Digikey: 311-0.0JRTR-ND; Order_Code_Farnell: 2363467

## Sheet MCU.SchDoc: MCU
size A4; Date: Not used; ApprovedBy: Not used; CheckedBy: Not used; Author: Not used; CompanyName: STMicroelectronics; DrawnBy: Not used; Engineer: Not used; Organization: Not used; Address1: Not used; Address2: Not used; Address3: Not used; Address4: Not used; DocumentNumber: Not used; Revision: Not used; SheetNumber: 3; SheetTotal: 6; CurrentTime: Not used; CurrentDate: Not used; Time: Not used; DocumentFullPathAndName: Not used; DocumentName: Not used; ModifiedDate: Not used; ImagePath: Not used; ProjectName: Not used; Application_BuildNumber: Not used
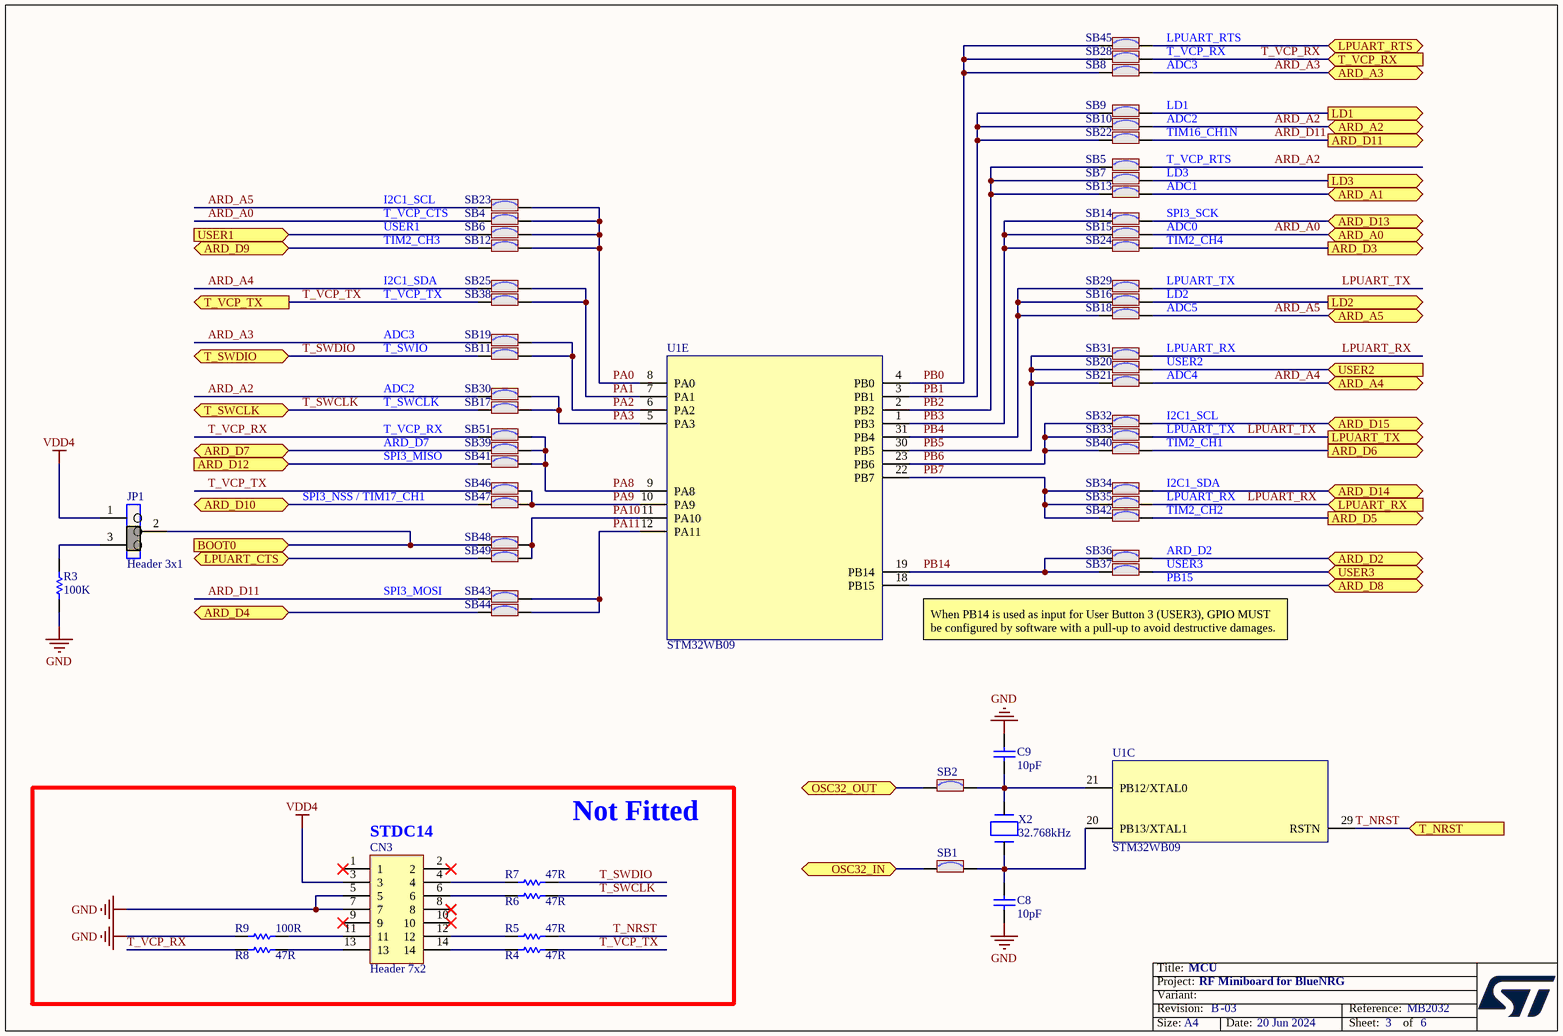
[diagram p5: MCU.SchDoc]

### Parts
C8  value 10pF  [C0402]  (hidden comment: Capacitor)
C9  value 10pF  [C0402]  (hidden comment: Capacitor)
CN3  Header 7x2  [CON_SAMTEC_FTSH-107-01-L-DV-K]
JP1  value Header 3x1  [CON_SAMTEC_TSW-103-07-F-S]  (hidden comment: Jumper_Header 3x1 Fitted 2-3)
R3  value 100K  [R0402]  (hidden comment: Resistor)
R4  value 47R  [R0402]  (hidden comment: Resistor)
R5  value 47R  [R0402]  (hidden comment: Resistor)
R6  value 47R  [R0402]  (hidden comment: Resistor)
R7  value 47R  [R0402]  (hidden comment: Resistor)
R8  value 47R  [R0402]  (hidden comment: Resistor)
R9  value 100R  [R0402]  (hidden comment: Resistor)
SB1  SB_ON  [SOLDER-BRIDGE_R0402-0R]  (value not drawn)
SB2  SB_ON  [SOLDER-BRIDGE_R0402-0R]  (value not drawn)
SB4  SB_ON  [SOLDER-BRIDGE_R0402-0R]  (value not drawn)
SB5  SB_ON  [SOLDER-BRIDGE_R0402-0R]  (value not drawn)
SB6  SB_ON  [SOLDER-BRIDGE_R0402-0R]  (value not drawn)
SB7  SB_ON  [SOLDER-BRIDGE_R0402-0R]  (value not drawn)
SB8  SB_ON  [SOLDER-BRIDGE_R0402-0R]  (value not drawn)
SB9  SB_ON  [SOLDER-BRIDGE_R0402-0R]  (value not drawn)
SB10  SB_ON  [SOLDER-BRIDGE_R0402-0R]  (value not drawn)
SB11  SB_ON  [SOLDER-BRIDGE_R0402-0R]  (value not drawn)
SB12  SB_ON  [SOLDER-BRIDGE_R0402-0R]  (value not drawn)
SB13  SB_ON  [SOLDER-BRIDGE_R0402-0R]  (value not drawn)
SB14  SB_ON  [SOLDER-BRIDGE_R0402-0R]  (value not drawn)
SB15  SB_ON  [SOLDER-BRIDGE_R0402-0R]  (value not drawn)
SB16  SB_ON  [SOLDER-BRIDGE_R0402-0R]  (value not drawn)
SB17  SB_ON  [SOLDER-BRIDGE_R0402-0R]  (value not drawn)
SB18  SB_ON  [SOLDER-BRIDGE_R0402-0R]  (value not drawn)
SB19  SB_ON  [SOLDER-BRIDGE_R0402-0R]  (value not drawn)
SB20  SB_ON  [SOLDER-BRIDGE_R0402-0R]  (value not drawn)
SB21  SB_ON  [SOLDER-BRIDGE_R0402-0R]  (value not drawn)
SB22  SB_ON  [SOLDER-BRIDGE_R0402-0R]  (value not drawn)
SB23  SB_ON  [SOLDER-BRIDGE_R0402-0R]  (value not drawn)
SB24  SB_ON  [SOLDER-BRIDGE_R0402-0R]  (value not drawn)
SB25  SB_ON  [SOLDER-BRIDGE_R0402-0R]  (value not drawn)
SB28  SB_ON  [SOLDER-BRIDGE_R0402-0R]  (value not drawn)
SB29  SB_ON  [SOLDER-BRIDGE_R0402-0R]  (value not drawn)
SB30  SB_ON  [SOLDER-BRIDGE_R0402-0R]  (value not drawn)
SB31  SB_ON  [SOLDER-BRIDGE_R0402-0R]  (value not drawn)
SB32  SB_ON  [SOLDER-BRIDGE_R0402-0R]  (value not drawn)
SB33  SB_ON  [SOLDER-BRIDGE_R0402-0R]  (value not drawn)
SB34  SB_ON  [SOLDER-BRIDGE_R0402-0R]  (value not drawn)
SB35  SB_ON  [SOLDER-BRIDGE_R0402-0R]  (value not drawn)
SB36  SB_ON  [SOLDER-BRIDGE_R0402-0R]  (value not drawn)
SB37  SB_ON  [SOLDER-BRIDGE_R0402-0R]  (value not drawn)
SB38  SB_ON  [SOLDER-BRIDGE_R0402-0R]  (value not drawn)
SB39  SB_ON  [SOLDER-BRIDGE_R0402-0R]  (value not drawn)
SB40  SB_ON  [SOLDER-BRIDGE_R0402-0R]  (value not drawn)
SB41  SB_ON  [SOLDER-BRIDGE_R0402-0R]  (value not drawn)
SB42  SB_ON  [SOLDER-BRIDGE_R0402-0R]  (value not drawn)
SB43  SB_ON  [SOLDER-BRIDGE_R0402-0R]  (value not drawn)
SB44  SB_ON  [SOLDER-BRIDGE_R0402-0R]  (value not drawn)
SB45  SB_ON  [SOLDER-BRIDGE_R0402-0R]  (value not drawn)
SB46  SB_ON  [SOLDER-BRIDGE_R0402-0R]  (value not drawn)
SB47  SB_ON  [SOLDER-BRIDGE_R0402-0R]  (value not drawn)
SB48  SB_ON  [SOLDER-BRIDGE_R0402-0R]  (value not drawn)
SB49  SB_ON  [SOLDER-BRIDGE_R0402-0R]  (value not drawn)
SB51  SB_ON  [SOLDER-BRIDGE_R0402-0R]  (value not drawn)
U1  STM32WB09  [ICC_QFN32-EPAD_5X5_P050]  (parts C,E of 5)
X2  value 32.768kHz  [CRY_NX2012SA_2P]  (hidden comment: XTAL_2_PINS)

### Blocks framed on the sheet
Not Fitted: CN3 R4-R9

### Ports
ARD_A0 (bidir), ARD_A1 (bidir), ARD_A2 (bidir), ARD_A3 (bidir), ARD_A4 (bidir), ARD_A5 (bidir), ARD_D2 (bidir), ARD_D3 (out), ARD_D4 (bidir), ARD_D5 (out), ARD_D6 (out), ARD_D7 (bidir), ARD_D8 (bidir), ARD_D9 (bidir), ARD_D10 (bidir), ARD_D11 (out), ARD_D12 (in), ARD_D13 (bidir), ARD_D14 (bidir), ARD_D15 (bidir), BOOT0 (in), LD1 (out), LD2 (out), LD3 (out), LPUART_CTS (bidir), LPUART_RTS (bidir), LPUART_RX (in), LPUART_TX (out), OSC32_IN (bidir), OSC32_OUT (bidir), T_NRST (in), T_SWCLK (bidir), T_SWDIO (bidir), T_VCP_RX (in), T_VCP_TX (out), USER1 (in), USER2 (in), USER3 (bidir)

### Nets
GND: C8.1 C9.2 CN3.5 CN3.7 R3.1 R9.1
VDD4: CN3.3 JP1.1
ARD_A0: SB4.1 SB15.2 ; port ARD_A0
ARD_A1: SB13.2 ; port ARD_A1
ARD_A2: SB5.2 SB10.2 SB30.1 ; port ARD_A2
ARD_A3: SB8.2 SB19.1 ; port ARD_A3
ARD_A4: SB21.2 SB25.1 ; port ARD_A4
ARD_A5: SB18.2 SB23.1 ; port ARD_A5
ARD_D2: SB36.2 ; port ARD_D2
ARD_D3: SB24.2 ; port ARD_D3
ARD_D4: SB44.1 ; port ARD_D4
ARD_D5: SB42.2 ; port ARD_D5
ARD_D6: SB40.2 ; port ARD_D6
ARD_D7: SB39.1 ; port ARD_D7
ARD_D8: U1.18(PB15) ; port ARD_D8
ARD_D9: SB12.1 ; port ARD_D9
ARD_D10: SB47.1 ; port ARD_D10
ARD_D11: SB22.2 SB43.1 ; port ARD_D11
ARD_D12: SB41.1 ; port ARD_D12
ARD_D13: SB14.2 ; port ARD_D13
ARD_D14: SB34.2 ; port ARD_D14
ARD_D15: SB32.2 ; port ARD_D15
BOOT0: JP1.2 SB48.1 ; port BOOT0
LD1: SB9.2 ; port LD1
LD2: SB16.2 ; port LD2
LD3: SB7.2 ; port LD3
LPUART_CTS: SB49.1 ; port LPUART_CTS
LPUART_RTS: SB45.2 ; port LPUART_RTS
LPUART_RX: SB31.2 SB35.2 ; port LPUART_RX
LPUART_TX: SB29.2 SB33.2 ; port LPUART_TX
OSC32_IN: SB1.1 ; port OSC32_IN
OSC32_OUT: SB2.1 ; port OSC32_OUT
PA0: SB4.2 SB6.2 SB12.2 SB23.2 U1.8(PA0)
PA1: SB25.2 SB38.2 U1.7(PA1)
PA2: SB11.2 SB19.2 U1.6(PA2)
PA3: SB17.2 SB30.2 U1.5(PA3)
PA8: SB39.2 SB41.2 SB51.1 U1.9(PA8)
PA9: SB46.2 SB47.2 U1.10(PA9)
PA10: SB48.2 SB49.2 U1.11(PA10)
PA11: SB43.2 SB44.2 U1.12(PA11)
PB0: SB8.1 SB28.1 SB45.1 U1.4(PB0)
PB1: SB9.1 SB10.1 SB22.1 U1.3(PB1)
PB2: SB5.1 SB7.1 SB13.1 U1.2(PB2)
PB3: SB14.1 SB15.1 SB24.1 U1.1(PB3)
PB4: SB16.1 SB18.1 SB29.1 U1.31(PB4)
PB5: SB20.1 SB21.1 SB31.1 U1.30(PB5)
PB6: SB32.1 SB33.1 SB40.1 U1.23(PB6)
PB7: SB34.1 SB35.1 SB42.1 U1.22(PB7)
PB14: SB36.1 SB37.1 U1.19(PB14)
T_NRST: R5.2 U1.29(RSTN) ; port T_NRST
T_SWCLK: R6.2 SB17.1 ; port T_SWCLK
T_SWDIO: R7.2 SB11.1 ; port T_SWDIO
T_VCP_RX: R8.1 SB28.2 SB51.2 ; port T_VCP_RX
T_VCP_TX: R4.2 SB38.1 SB46.1 ; port T_VCP_TX
USER1: SB6.1 ; port USER1
USER2: SB20.2 ; port USER2
USER3: SB37.2 ; port USER3
NetC8_2: C8.2 SB1.2 U1.20(PB13/XTAL1) X2.2(X2)
NetC9_1: C9.1 SB2.2 U1.21(PB12/XTAL0) X2.1(X1)
NetCN3_4: CN3.4 R7.1
NetCN3_6: CN3.6 R6.1
NetCN3_11: CN3.11 R9.2
NetCN3_12: CN3.12 R5.1
NetCN3_13: CN3.13 R8.2
NetCN3_14: CN3.14 R4.1
NetJP1_3: JP1.3 R3.2

Not connected (* = marked no-connect by the designer): CN3 1* 2* 8* 9* 10*

### Notes on the sheet
- LPUART_RTS
- ADC3
- T_VCP_RX
- LD1
- ADC2
- LD3
- TIM16_CH1N
- T_VCP_RTS
- TIM2_CH3
- T_VCP_CTS
- I2C1_SCL
- USER1
- ADC0
- ADC1
- TIM2_CH4
- SPI3_SCK
- I2C1_SDA
- T_VCP_TX
- ADC5
- LD2
- LPUART_TX
- T_SWIO
- ADC4
- LPUART_RX
- USER2
- T_SWCLK
- ARD_D7
- TIM2_CH1
- SPI3_NSS / TIM17_CH1
- SPI3_MISO
- TIM2_CH2
- ARD_D2
- USER3
- PB15
- SPI3_MOSI
- When PB14 is used as input for User Button 3 (USER3), GPIO MUST be configured by software with a pull-up to avoid destructive damages.
- (near CN3) STDC14
- Title:
- Project:
- Size:
- Revision:
- Variant:
- A4
- -
- Date:
- Reference:
- Sheet:
- of

### Library data of the parts
C8 C9 = MCD-00015: Capacitor, MLCC, 10pF, 50V, NPO, +/-5%, 0402, T=0.5mm; Part_Preference: Recommended; Manufacturer: YAGEO; Manufacturer_Part_Number: CC0402JRNPO9BN100; Order_Code_RS: 3019160RL; Component_Country_Of_Origin: China; ShowFields: YES; ID: 2465; Internal_Part_Number: MCD-00015; Status: Released; Part_Type: Capacitor; Package: 0402; ComponentLink1URL: http://tunmcdsvn.tun.st.com/Component_Documentation_Library/Trunk/Capacitor/YAGEO_NP0_Series; Order_Code_Digikey: 311-1014-1-ND; Order_Code_Farnell: 3019160RL
CN3 = MCD-01531: Header, 7x2, 1.27mm, VR, T=5.97mm, FTSH series STDC14 without Alignment Pin; Part_Type: Connector; Part_Preference: Recommended; Manufacturer: SAMTEC; Manufacturer_Part_Number: FTSH-107-01-L-DV-K; Order_Code_RS: 179-9021; Component_Country_Of_Origin: China, Costa Rica, Malaysia, United States, Vietnam; ShowFields: YES; ID: 3631; Internal_Part_Number: MCD-01531; Value: Header 7x2; Status: Checked; ComponentLink1URL: http://tunmcdsvn.tun.st.com/Component_Documentation_Library/Trunk/Connector/SAMTEC_FTSH_Series/; Order_Code_Digikey: SAM9449-ND; Order_Code_Farnell: 2856443
JP1 = MCD-00685: Header, 3x1, 2.54mm, VR, TH, T=5.84mm/2.54mm; Part_Type: Connector; Part_Preference: Recommended; Manufacturer: SAMTEC; Manufacturer_Part_Number: TSW-103-07-F-S; Order_Code_RS: 161-2248; Component_Country_Of_Origin: China, Costa Rica, Malaysia, United States, Vietnam; ShowFields: YES; ID: 3058; Internal_Part_Number: MCD-00685; Status: Released; ComponentLink1URL: http://tunmcdsvn.tun.st.com/Component_Documentation_Library/Trunk/Connector/SAMTEC_TSW_Series/; Order_Code_Digikey: SAM8995-ND; Order_Code_Farnell: 2505043
R3 = MCD-00059: Resistor, 100K, 0402, +/-1%, 1/16W; Part_Preference: Recommended; Manufacturer: YAGEO; Manufacturer_Part_Number: RC0402FR-07100KL; Partial_Alternate_Internal_Part_Number: MCD-03301; Order_Code_RS: 2421891; Component_Country_Of_Origin: China; ShowFields: YES; ID: 2533; Internal_Part_Number: MCD-00059; Status: Released; Part_Type: Resistor; Package: 0402; ComponentLink1URL: http://tunmcdsvn.tun.st.com/Component_Documentation_Library/Trunk/Resistor/YAGEO_RC_L_Series; Order_Code_Digikey: 311-100KLRTR-ND; Order_Code_Farnell: 2421891
R4-R8 = MCD-00481: Resistor, 47R, 0402, +/-1%, 1/16W; Part_Preference: Recommended; Manufacturer: YAGEO; Manufacturer_Part_Number: RC0402FR-0747RL; Component_Country_Of_Origin: China; ShowFields: YES; ID: 2796; Internal_Part_Number: MCD-00481; Status: Released; Part_Type: Resistor; Package: 0402; ComponentLink1URL: http://tunmcdsvn.tun.st.com/Component_Documentation_Library/Trunk/Resistor/YAGEO_RC_L_Series; Order_Code_Digikey: 311-47.0LRCT-ND; Order_Code_Farnell: 9239073; Order_Code_RS: N/A
R9 = MCD-00067: Resistor, 100R, 0402, +/- 1%, 1/16W; Part_Preference: Recommended; Manufacturer: YAGEO; Manufacturer_Part_Number: RC0402FR-07100RL; Order_Code_RS: 9239111; Component_Country_Of_Origin: China; ShowFields: YES; ID: 2527; Internal_Part_Number: MCD-00067; Status: Released; Part_Type: Resistor; Package: 0402; ComponentLink1URL: http://tunmcdsvn.tun.st.com/Component_Documentation_Library/Trunk/Resistor/YAGEO_RC_L_Series; Order_Code_Digikey: 311-100LRCT-ND; Order_Code_Farnell: 9239111
SB1 SB2 SB4-SB25 SB28-SB49 SB51 = MCD-01618: as SB52 on sheet Connectors; Internal_Part_Number: MCD-01618; Status: Released; Package: 0402; ComponentLink1URL: http://tunmcdsvn.tun.st.com/Component_Documentation_Library/Trunk/Resistor/YAGEO_RC0402_Series; Order_Code_Digikey: 311-0.0JRTR-ND; Order_Code_Farnell: 2363467
U1 = MCD-03444: as U1 on sheet RF; Internal_Part_Number: MCD-03444; Value: STM32WB09; Status: Checked; Manufacturer_Part_Number: STM32WB09; Package: QFN32; ComponentLink1URL: http://tunmcdsvn.tun.st.com/Component_Documentation_Library/Trunk/IC/STMICROELECTRONICS_BLUENRG-372AC; Order_Code_Digikey: N/A; Order_Code_Farnell: N/A; Order_Code_RS: N/A
X2 = MCD-01445: Crystal, 32.768kHz, 7pF, +/-20ppm, 80K, 2.05x1.2mm; BMS_Part_Number: 9157043; Part_Type: Crystal_Osc; Part_Preference: Recommended; Manufacturer: NDK; Manufacturer_Part_Number: NX2012SA-32.768KHZ-EXS00A-MU00389; Component_Country_Of_Origin: Unknown; ShowFields: YES; ID: 3545; Internal_Part_Number: MCD-01445; Status: Checked; Package: 2.05x1.2mm; ComponentLink1URL: http://tunmcdsvn.tun.st.com/Component_Documentation_Library/Trunk/Crytal_Oscillator/NDK_NX2012SA_Series; Order_Code_Digikey: 644-1350; Order_Code_Farnell: N/A; Order_Code_RS: N/A

## Nets that join several sheets
GND: RF (20 pins), Power_Supply (11 pins), Connectors (23 pins), MCU (6 pins)
VDD1: RF (C3.2 C4.2 U1.15), Connectors (CN1.2)
VDD2: Power_Supply (C5.2 C6.2 U1.13), Connectors (CN1.11)
VDD3: Power_Supply (SB3.2), Connectors (CN1.18)
VDD4: Power_Supply (C10.2 C13.2 U1.32), Connectors (CN1.30), MCU (CN3.3 JP1.1)
VDD5: Power_Supply (C11.2 C14.2 U1.24), Connectors (CN1.32)
ARD_A0: Connectors (CN1.24), MCU (SB4.1 SB15.2)
ARD_A1: Connectors (CN1.26), MCU (SB13.2)
ARD_A2: Connectors (CN1.36), MCU (SB5.2 SB10.2 SB30.1)
ARD_A3: Connectors (CN1.38), MCU (SB8.2 SB19.1)
ARD_A4: Connectors (CN1.42), MCU (SB21.2 SB25.1)
ARD_A5: Connectors (CN1.44), MCU (SB18.2 SB23.1)
ARD_D2: Connectors (CN2.41), MCU (SB36.2)
ARD_D3: Connectors (CN2.39), MCU (SB24.2)
ARD_D4: Connectors (CN2.37), MCU (SB44.1)
ARD_D5: Connectors (CN2.35), MCU (SB42.2)
ARD_D6: Connectors (CN2.29), MCU (SB40.2)
ARD_D7: Connectors (CN2.27), MCU (SB39.1)
ARD_D8: Connectors (CN2.25), MCU (U1.18)
ARD_D9: Connectors (CN2.23), MCU (SB12.1)
ARD_D10: Connectors (CN2.21), MCU (SB47.1)
ARD_D11: Connectors (CN2.15), MCU (SB22.2 SB43.1)
ARD_D12: Connectors (CN2.13), MCU (SB41.1)
ARD_D13: Connectors (CN2.11), MCU (SB14.2)
ARD_D14: Connectors (CN2.9), MCU (SB34.2)
ARD_D15: Connectors (CN2.7), MCU (SB32.2)
BOOT0: Connectors (CN1.9), MCU (JP1.2 SB48.1)
LD1: Connectors (CN2.10), MCU (SB9.2)
LD2: Connectors (CN1.29), MCU (SB16.2)
LD3: Connectors (CN2.48), MCU (SB7.2)
LPUART_CTS: Connectors (SB52.2 SB53.2), MCU (SB49.1)
LPUART_RTS: Connectors (CN1.8), MCU (SB45.2)
LPUART_RX: Connectors (SB57.1), MCU (SB31.2 SB35.2)
LPUART_TX: Connectors (SB55.1), MCU (SB29.2 SB33.2)
OSC32_IN: Connectors (CN1.33), MCU (SB1.1)
OSC32_OUT: Connectors (CN1.35), MCU (SB2.1)
T_NRST: Connectors (CN1.12), MCU (R5.2 U1.29)
T_SWCLK: Connectors (CN1.15), MCU (R6.2 SB17.1)
T_SWDIO: Connectors (CN1.13), MCU (R7.2 SB11.1)
T_VCP_RX: Connectors (CN1.45 SB56.1), MCU (R8.1 SB28.2 SB51.2)
T_VCP_TX: Connectors (CN1.47 SB54.1), MCU (R4.2 SB38.1 SB46.1)
USER1: Connectors (CN2.46), MCU (SB6.1)
USER2: Connectors (CN2.40), MCU (SB20.2)
USER3: Connectors (CN2.42), MCU (SB37.2)

## Assembly variants
WB09: not fitted C1 C10 CN3 CN4 R2 R4 R5 R6 R7 R8 R9 SB1 SB2 SB3 SB4 SB5 SB8 SB10 SB12 SB13 SB15 SB18 SB19 SB21 SB22 SB23 SB24 SB25 SB29 SB30 SB31 SB33 SB35 SB36 SB39 SB40 SB42 SB44 SB45 SB46 SB49 SB51 SB52 SB53 SB54 SB56
WB05: not fitted C1 C10 CN3 CN4 JP1 R2 R4 R5 R6 R7 R8 R9 SB1 SB2 SB3 SB4 SB5 SB8 SB10 SB12 SB13 SB15 SB18 SB19 SB21 SB22 SB23 SB24 SB25 SB29 SB30 SB31 SB33 SB35 SB36 SB39 SB40 SB42 SB44 SB45 SB46 SB49 SB51 SB52 SB53 SB54 SB56
WB05N: not fitted C1 C10 CN3 CN4 R2 R4 R5 R6 R7 R8 R9 SB1 SB2 SB3 SB4 SB5 SB8 SB10 SB12 SB13 SB15 SB18 SB19 SB21 SB22 SB23 SB24 SB25 SB29 SB30 SB31 SB33 SB35 SB36 SB39 SB40 SB42 SB44 SB45 SB46 SB49 SB51 SB52 SB53 SB54 SB55 SB56 SB57